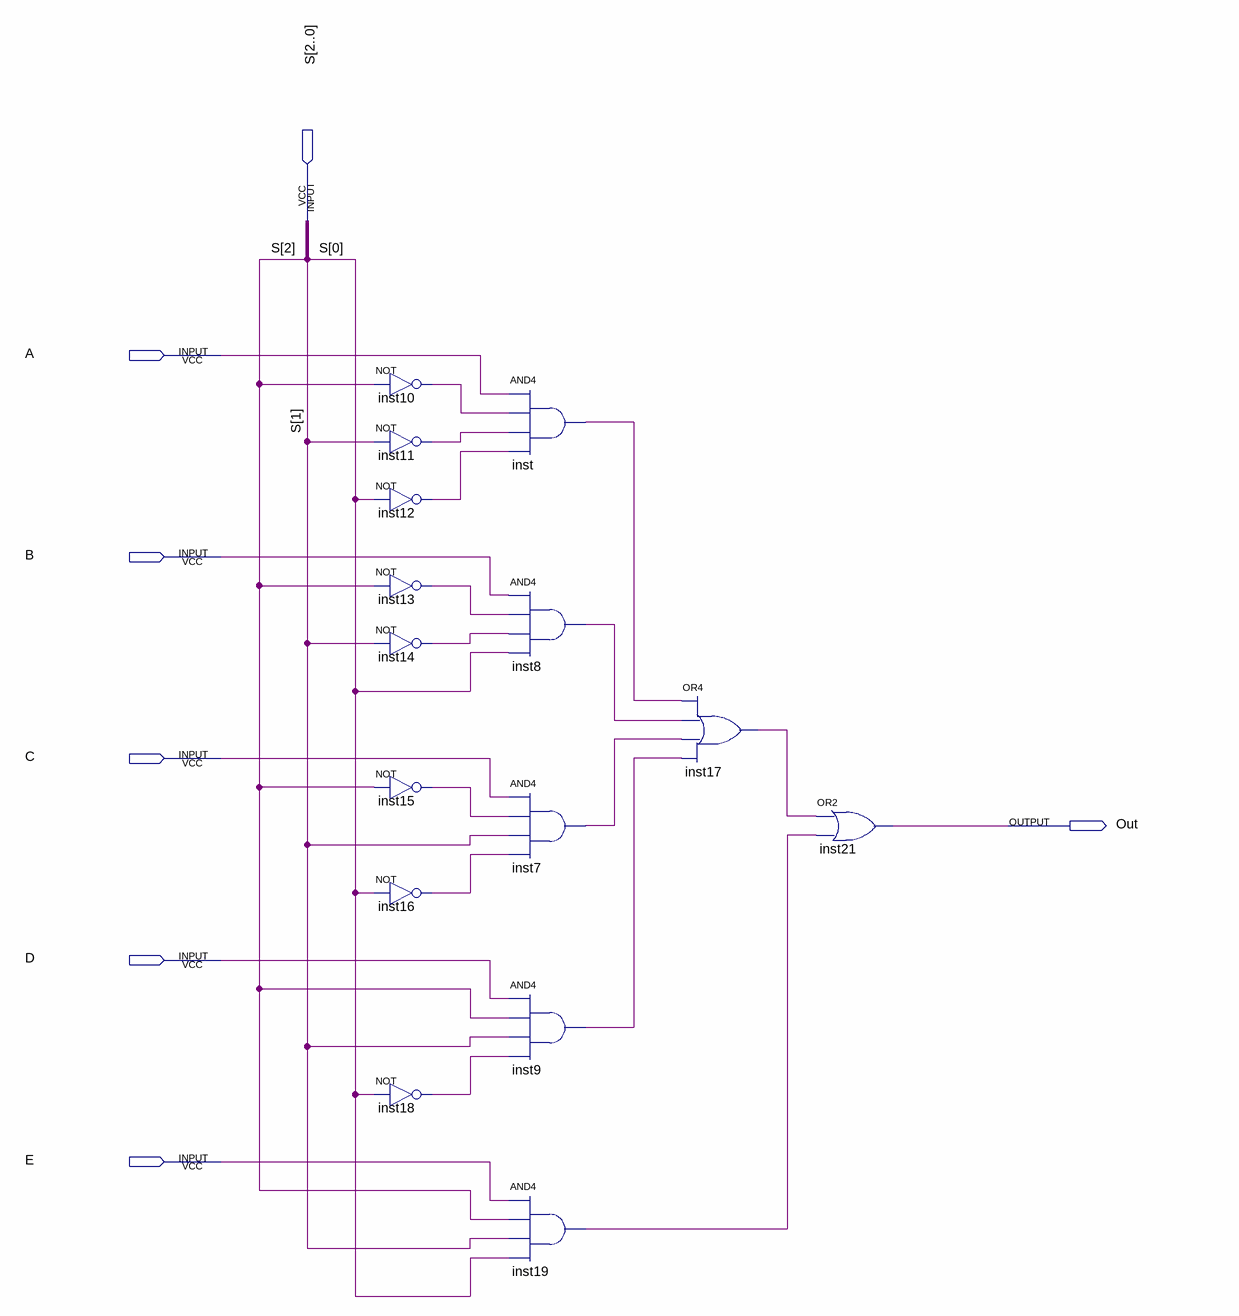
[diagram p0: schematic sheet]
// Quartus schematic mux_5_1bit.bdf as structural Verilog: 15 symbols, 7 pins
module mux_5_1bit (
  input  [2:0] S,
  input  A,
  input  B,
  input  C,
  input  D,
  input  E,
  output Out
);

  wire inst7_out, inst8_out, inst9_out, inst10_out, inst11_out, inst12_out, inst13_out, inst14_out,
       inst15_out, inst16_out, inst17_out, inst18_out, inst19_out, inst_out;

  not inst10 (inst10_out, S[2]);
  not inst11 (inst11_out, S[1]);
  not inst12 (inst12_out, S[0]);
  not inst13 (inst13_out, S[2]);
  not inst14 (inst14_out, S[1]);
  not inst15 (inst15_out, S[2]);
  not inst16 (inst16_out, S[0]);
  not inst18 (inst18_out, S[0]);
  and inst (inst_out, A, inst10_out, inst11_out, inst12_out);
  and inst8 (inst8_out, B, inst13_out, inst14_out, S[0]);
  and inst7 (inst7_out, C, inst15_out, S[1], inst16_out);
  and inst9 (inst9_out, D, S[2], S[1], inst18_out);
  and inst19 (inst19_out, E, S[2], S[1], S[0]);
  or inst17 (inst17_out, inst_out, inst8_out, inst7_out, inst9_out);
  or inst21 (Out, inst17_out, inst19_out);
endmodule
